# Altium schematic sheet Power.SchDoc
size A; DocumentNumber: 1; SheetNumber: 1; SheetTotal: 4
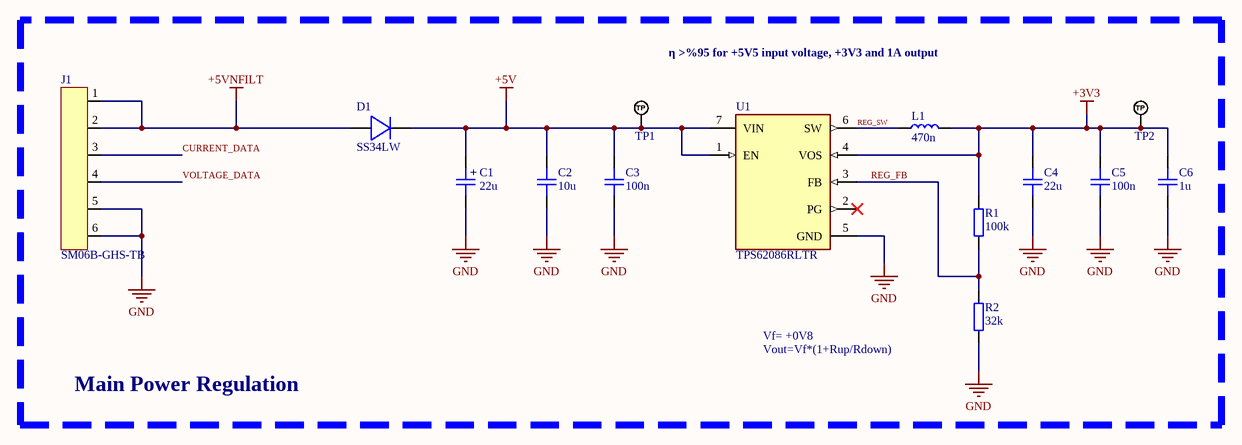
[diagram p0: Power.SchDoc]

## Parts
C1  22u  [CAP_AE_SMD_D6MM3_H5M55]
C2  10u  [CAP_1206]
C3  100n  [CAP_0402]
C4  22u  [CAP_1210]
C5  100n  [CAP_0402]
C6  1u  [CAP_0402]
D1  SS34LW  [SOD-123W]
J1  SM06B-GHS-TB  [SM06B-GHS-TB]
L1  470n  [IND_1008]
R1  100k  [RES_0402]
R2  32k  [RES_0402]
TP1  TP_NOBOM  [PAD_RND_1MM]  (value not drawn)  (no BOM)
TP2  TP_NOBOM  [PAD_RND_1MM]  (value not drawn)  (no BOM)
U1  TPS62086RLTR  [FP-RLT0007A-MFG]

## Nets
+3V3: C4.2 C5.2 C6.2 L1.2 R1.2 TP2.1(TP) U1.4(VOS)
+5V: C1.1 C2.2 C3.2 D1.2 TP1.1(TP) U1.1(EN) U1.7(VIN)
+5VNFILT: D1.1 J1.1 J1.2
GND: C1.2 C2.1 C3.1 C4.1 C5.1 C6.1 J1.5 J1.6 R2.1 U1.5(GND)
CURRENT_DATA: J1.3
REG_FB: R1.1 R2.2 U1.3(FB)
REG_SW: L1.1 U1.6(SW)
VOLTAGE_DATA: J1.4

Not connected (* = marked no-connect by the designer): U1 2(PG)*

## Notes on the sheet
- η >%95 for +5V5 input voltage, +3V3 and 1A output
- Vout=Vf*(1+Rup/Rdown)
- Vf= +0V8
- Main Power Regulation
- (in symbol CAP_ALEL_6.3x5.5) +

## Library data of the parts
C1 = CAP_ALEL_6.3x5.5: Capacitor SMD Aluminium Electrolytic 6.3mm Diameter 5.5mm Height; Manufacturer: *; Manufacturer Part Number: *; Distributor Link: *; LCSC: *
C2 = CAP_1206: Capacitor SMD 1206; Manufacturer: *; Manufacturer Part Number: *; Distributor Link: *; LCSC: *; Rating: *; Dielectric: *
C3 C5 C6 = CAP_0402: Capacitor SMD 0402; Manufacturer: *; Manufacturer Part Number: *; Distributor Link: *; LCSC: *; Rating: *; Dielectric: *
C4 = CAP_1210: Capacitor SMD 1210; Manufacturer: *; Manufacturer Part Number: *; Distributor Link: *; LCSC: *; Rating: *; Dielectric: *
D1 = SS34LW: 3A, 40V - 200V Schottky Barrier Surface Mount Rectifier
J1 = SM06B-GHS-TB: Header Connector 6 Position 1.25MM Pitch SMD Horizontal JST GH; Manufacturer: JST; Manufacturer Part Number: SM06B-GHS-TB
L1 = IND_1008: Inductor SMD 1008
R1 R2 = RES_0402: Resistor SMD 0402; Manufacturer: *; Manufacturer Part Number: *; Distributor Link: *; LCSC: *
TP1 TP2 = TEST_POINT_RND_1MM: Test Point Round 1mm (NO BOM)
U1 = CMP-04918-000186-1: IC REG BUCK 3.3V 3A 7VSON-HR; Switching Frequency: 2.4MHz; Output Type: Fixed; Output Configuration: Positive; Synchronous Rectifier: Yes; Min Input Voltage: 2.5V; Operating Supply Voltage: 6V; Efficiency: 95%; Number of Outputs: 1; Package Quantity: 3000; Packaging: Tape and Reel; Output Voltage: 3.3V; Case/Package: VQFN; RoHS Compliant: Yes; Output Current: 3A; Max Input Voltage: 6V; Min Operating Temperature: -40°C; Lead Free: Lead Free; Max Operating Temperature: 125°C; Mount: Surface Mount; Number of Pins: 7; Min Output Voltage: 3.3V; Radiation Hardening: No; Max Output Current: 3A